# Altium schematic sheet Layout.SchDoc
size A; SheetNumber: 1; SheetTotal: 6
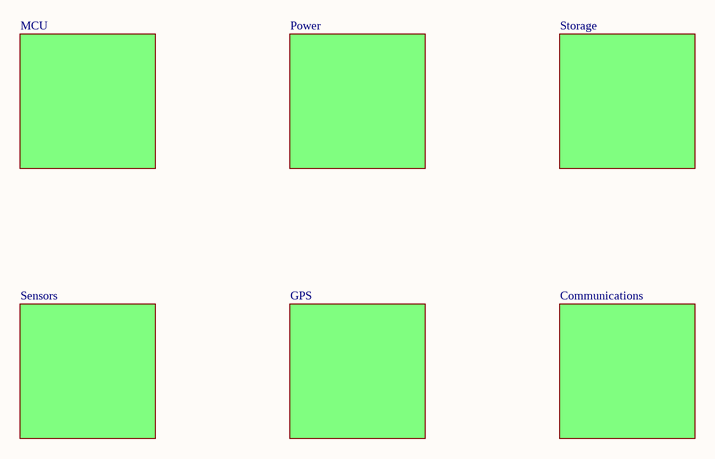
[diagram p0: Layout.SchDoc]

## Sub-sheets
Designator = Power: no entries
Designator = Sensors: no entries
Designator = Storage: no entries
Designator = GPS: no entries
Designator = Communications: no entries
MCU = MCU: no entries